# Altium schematic sheet Sheet1.SchDoc
size A1
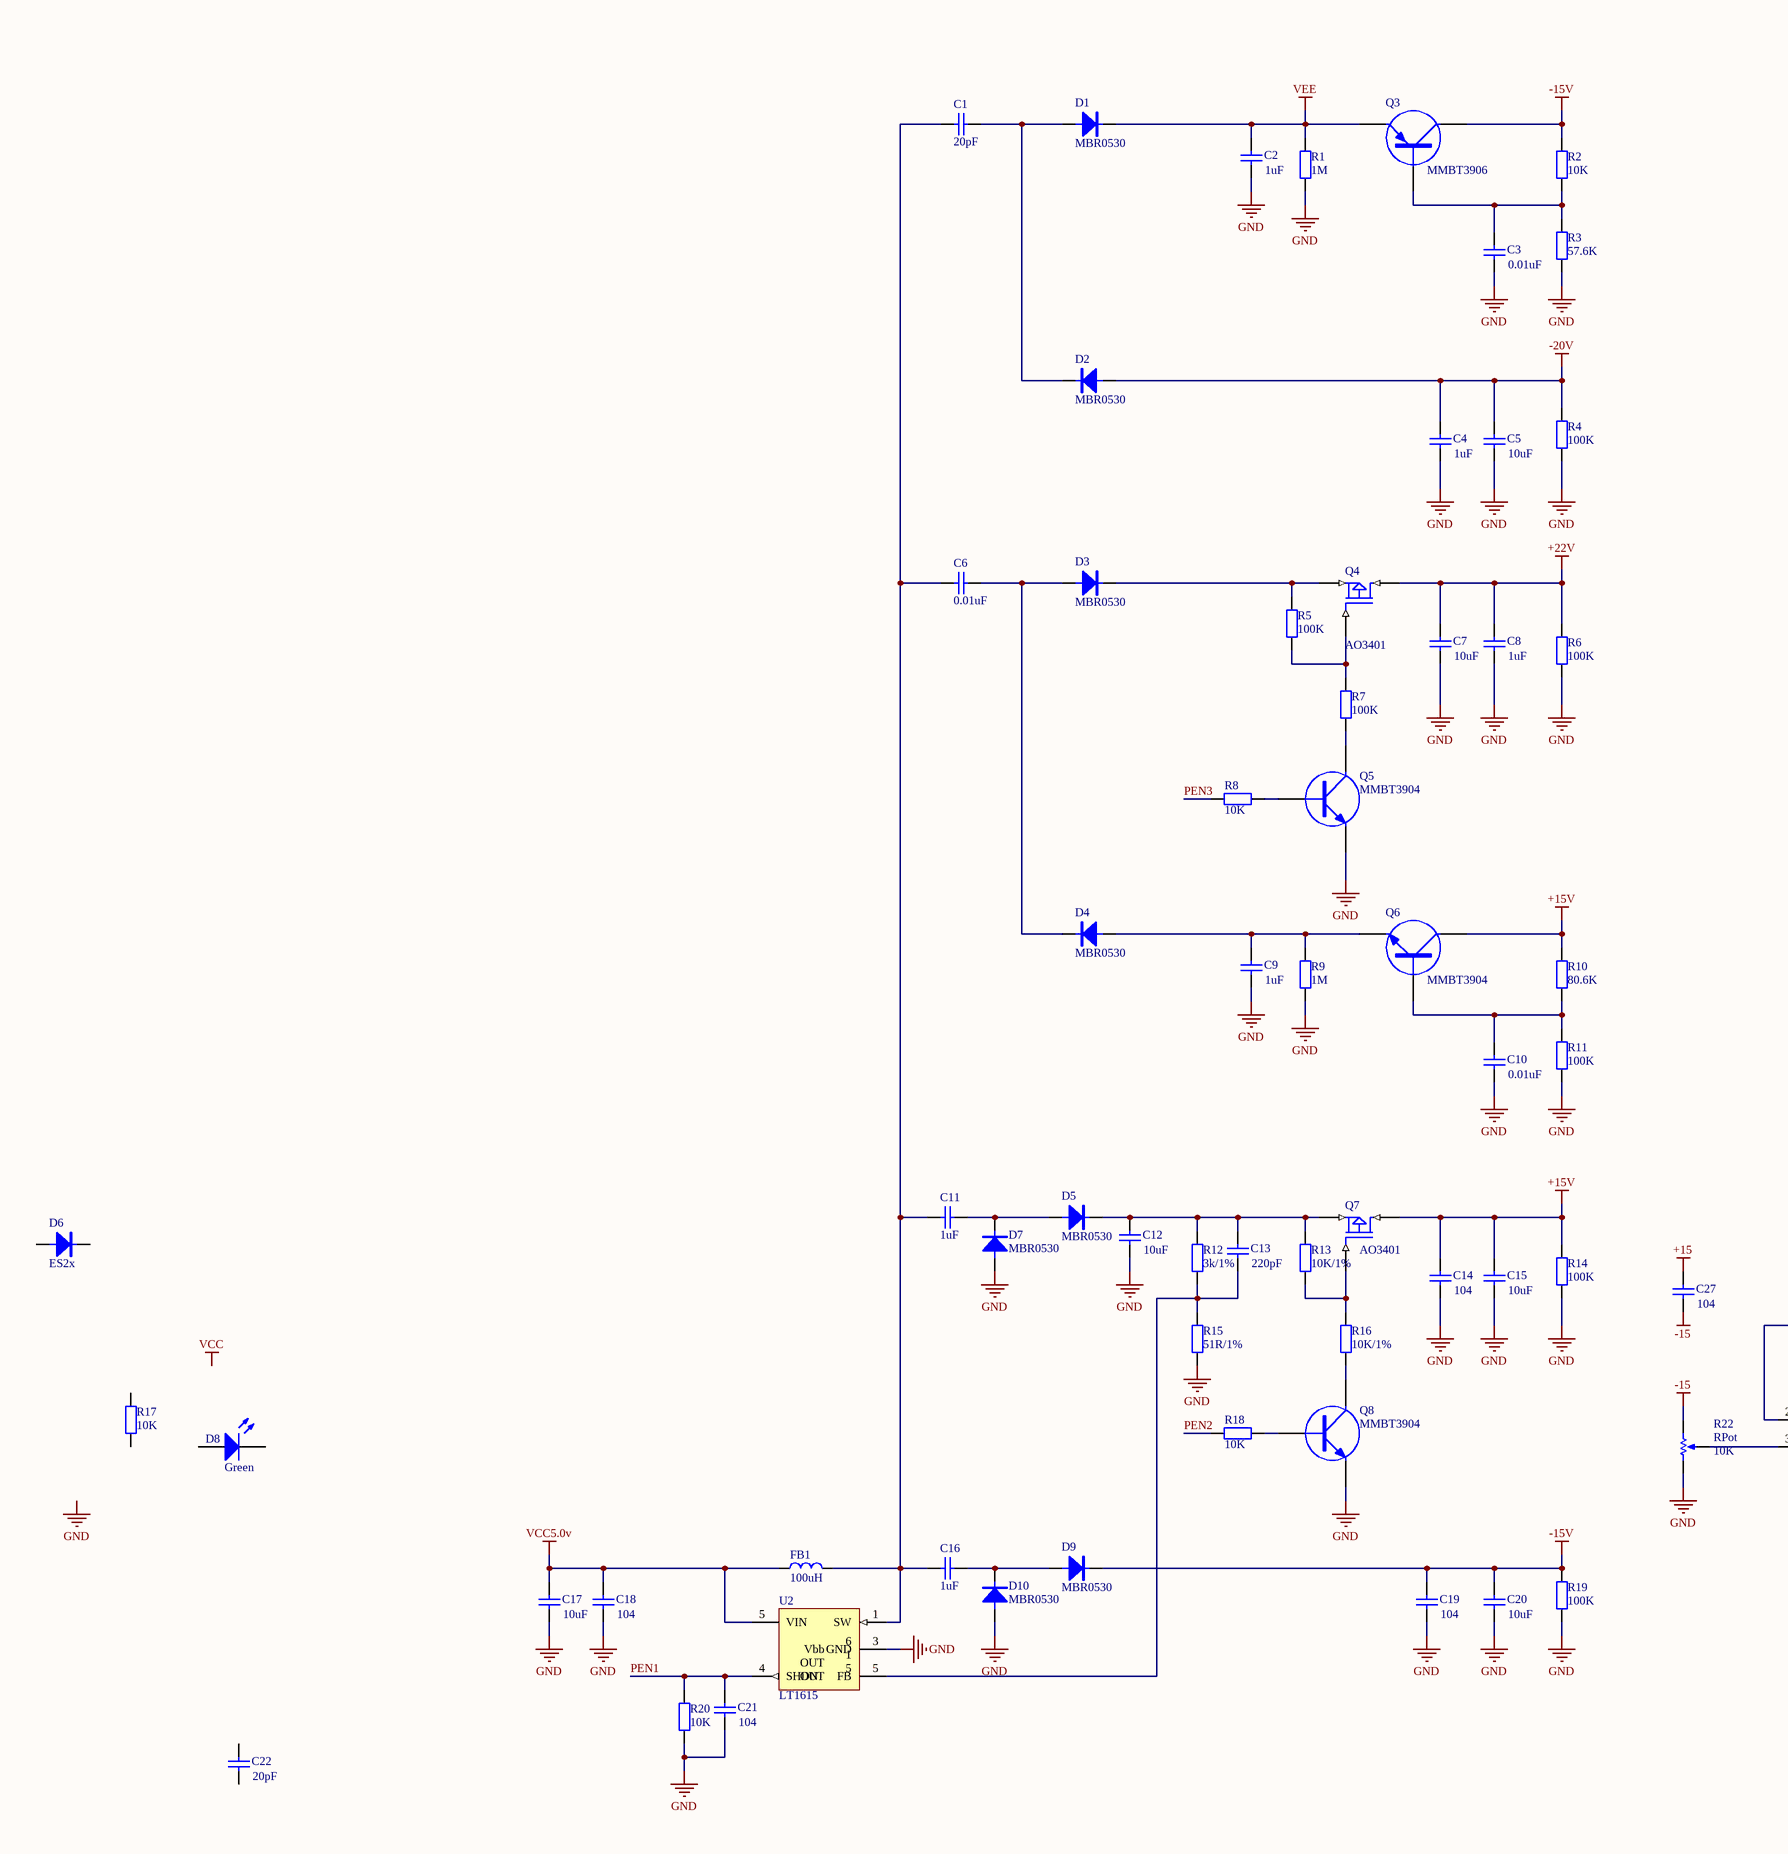
[diagram p0: Sheet1.SchDoc, left]
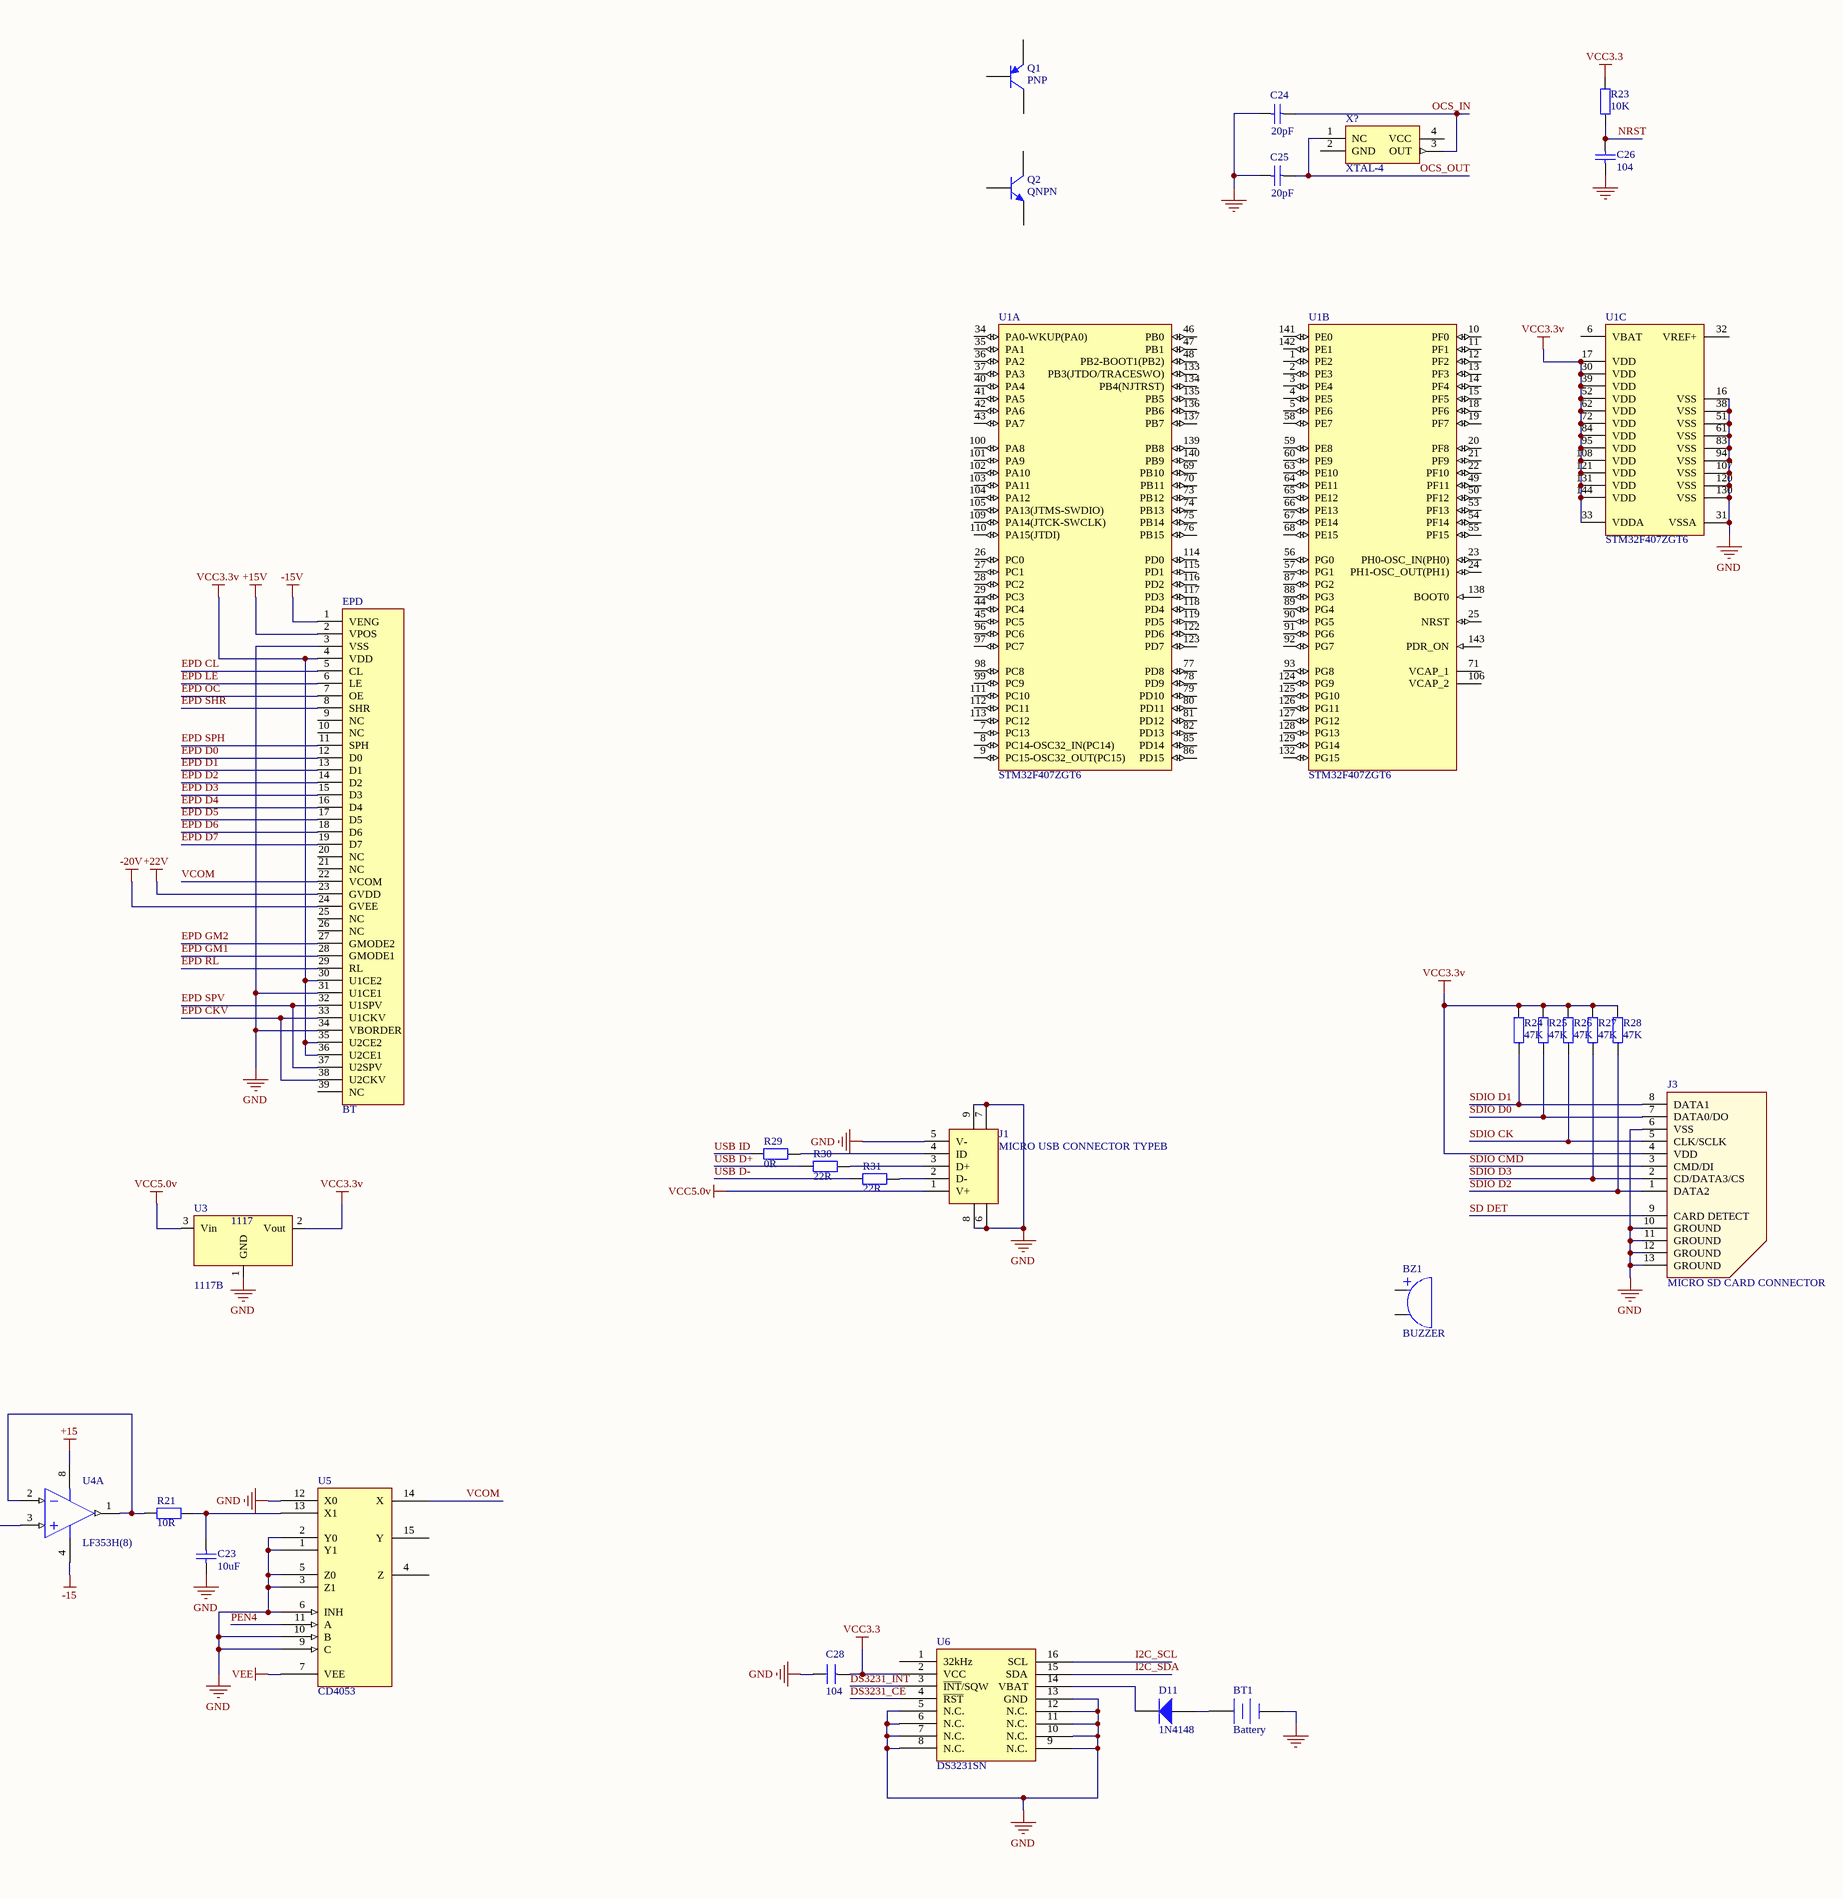
[diagram p1: Sheet1.SchDoc, right]

## Parts
BT1  Battery  [CR1220]
BZ1  BUZZER  [BUZZER-D12.0X8.5-6.5-0.8]
C1  20pF  [C0805]
C2  1uF  [C0805]
C3  0.01uF  [C0805]
C4  1uF  [C0805]
C5  10uF  [C0805]
C6  0.01uF  [C0805]
C7  10uF  [C0805]
C8  1uF  [C0805]
C9  1uF  [C0805]
C10  0.01uF  [C0805]
C11  1uF  [C0805]
C12  10uF  [C0805]
C13  220pF  [C0805]
C14  104  [C0805]
C15  10uF  [C0805]
C16  1uF  [C0805]
C17  10uF  [C0805]
C18  104  [C0805]
C19  104  [C0805]
C20  10uF  [C0805]
C21  104  [C0805]
C22  20pF  [C0805]
C23  10uF  [C0805]
C24  20pF  [C0805]
C25  20pF  [C0805]
C26  104  [C0805]
C27  104  [C0805]
C28  104  [C0805]
D1  MBR0530  [SMB]
D2  MBR0530  [SMB]
D3  MBR0530  [SMB]
D4  MBR0530  [SMB]
D5  MBR0530  [SMB]
D6  ES2x  [SMB]
D7  MBR0530  [SMB]
D8  Green  [C0805]
D9  MBR0530  [SMB]
D10  MBR0530  [SMB]
D11  1N4148  [425]
EPD  BT  [39FXL - duplicate]
FB1  100uH  [0805]
J1  MICRO USB CONNECTOR TYPEB  [MICRO USB CONNECTOR TYPEB-ST-MC-5F-01]
J3  MICRO SD CARD CONNECTOR  [MICRO SD CARD CONNECTOR]
Q1  PNP  [SOT-23B_N]
Q2  QNPN  [SOT-23B_N]
Q3  MMBT3906
Q4  AO3401
Q5  MMBT3904  [TO-92B]
Q6  MMBT3904  [TO-92B]
Q7  AO3401
Q8  MMBT3904  [TO-92B]
R1  1M  [C0805]
R2  10K  [C0805]
R3  57.6K  [C0805]
R4  100K  [C0805]
R5  100K  [C0805]
R6  100K  [C0805]
R7  100K  [C0805]
R8  10K  [C0805]
R9  1M  [C0805]
R10  80.6K  [C0805]
R11  100K  [C0805]
R12  3k/1%  [C0805]
R13  10K/1%  [C0805]
R14  100K  [C0805]
R15  51R/1%  [C0805]
R16  10K/1%  [C0805]
R17  10K  [C0805]
R18  10K  [C0805]
R19  100K  [C0805]
R20  10K  [C0805]
R21  10R  [C0805]
R22  RPot  value 10K  [VR5]
R23  10K  [C0805]
R24  47K  [C0805]
R25  47K  [C0805]
R26  47K  [C0805]
R27  47K  [C0805]
R28  47K  [C0805]
R29  0R  [C0805]
R30  22R  [C0805]
R31  22R  [C0805]
U1  STM32F407ZGT6  [STM-LQFP144_N]  (parts A,B,C of 3)
U2  LT1615
U3  1117B  [SOT-223]
U4  LF353H(8)  [SO-8]  (part A of 2)
U5  CD4053  [SO-16]
U6  DS3231SN  [DS3231]
X?  XTAL-4  [XTAL-5.0X3.2]

## Nets
+15: C27.1 U4.8(V+)
+15V: C14.1 C15.1 EPD.2(VPOS) Q6.3(C) Q7.2(D) R10.1 R14.1
+22V: C7.1 C8.1 EPD.23(GVDD) Q4.2(D) R6.1
-15: C27.2 R22.2(BOT) U4.4(V-)
-15V: C19.1 C20.1 D9.2(C) EPD.1(VENG) Q3.3(C) R2.1 R19.2
-20V: C4.1 C5.1 D2.1(A) EPD.24(GVEE) R4.1
GND: BT1.2(-) C2.2 C3.2 C4.2 C5.2 C7.2 C8.2 C9.2 C10.2 C12.1 C14.2 C15.2 C17.2 C18.2 C19.2 C20.2 C21.2 C23.2 C24.2 C25.2 C26.1 C28.2 D7.1(A) D10.1(A) EPD.3(VSS) EPD.31(U1CE1) EPD.34(VBORDER) J1.5(V-) J1.6 J1.7 J1.8 J1.9 J3.6(VSS) J3.10(GROUND) J3.11(GROUND) J3.12(GROUND) J3.13(GROUND) Q5.2(E) Q8.2(E) R1.2 R3.2 R4.2 R6.2 R9.2 R11.2 R14.2 R15.2 R19.1 R20.2 R22.1(TOP) U1.16(VSS) U1.31(VSSA) U1.38(VSS) U1.51(VSS) U1.61(VSS) U1.83(VSS) U1.94(VSS) U1.107(VSS) U1.120(VSS) U1.130(VSS) U2.3(GND) U3.1(GND) U5.1(Y1) U5.2(Y0) U5.3(Z1) U5.5(Z0) U5.6(INH) U5.8(GND) U5.9(C) U5.10(B) U5.12(X0) U6.5(N.C.) U6.6(N.C.) U6.7(N.C.) U6.8(N.C.) U6.9(N.C.) U6.10(N.C.) U6.11(N.C.) U6.12(N.C.) U6.13(GND)
VCC: U5.16(VCC)
VCC3.3: C28.1 R23.2 U6.2(VCC)
VCC3.3v: EPD.4(VDD) EPD.30(U1CE2) EPD.35(U2CE2) EPD.36(U2CE1) J3.4(VDD) R24.2 R25.2 R26.2 R27.2 R28.2 U1.17(VDD) U1.30(VDD) U1.33(VDDA) U1.39(VDD) U1.52(VDD) U1.62(VDD) U1.72(VDD) U1.84(VDD) U1.95(VDD) U1.108(VDD) U1.121(VDD) U1.131(VDD) U1.144(VDD) U3.2(Vout)
VCC5.0v: C17.1 C18.1 FB1.1 J1.1(V+) U2.5(VIN) U3.3(Vin)
VEE: C2.1 D1.2(C) Q3.2(E) R1.1 U5.7(VEE)
DS3231_CE: U6.4(~{RST})
DS3231_INT: U6.3(~{INT}/SQW)
EPD CKV: EPD.33(U1CKV) EPD.38(U2CKV)
EPD CL: EPD.5(CL)
EPD D0: EPD.12(D0)
EPD D1: EPD.13(D1)
EPD D2: EPD.14(D2)
EPD D3: EPD.15(D3)
EPD D4: EPD.16(D4)
EPD D5: EPD.17(D5)
EPD D6: EPD.18(D6)
EPD D7: EPD.19(D7)
EPD GM1: EPD.28(GMODE1)
EPD GM2: EPD.27(GMODE2)
EPD LE: EPD.6(LE)
EPD OC: EPD.7(OE)
EPD RL: EPD.29(RL)
EPD SHR: EPD.8(SHR)
EPD SPH: EPD.11(SPH)
EPD SPV: EPD.32(U1SPV) EPD.37(U2SPV)
I2C_SCL: U6.16(SCL)
I2C_SDA: U6.15(SDA)
NRST: C26.2 R23.1
OCS_IN: C24.1 X?.3(OUT)
OCS_OUT: C25.1 X?.1(NC)
PEN1: C21.1 R20.1 U2.4(SHDN)
PEN2: R18.1
PEN3: R8.1
PEN4: U5.11(A)
SD DET: J3.9(CARD_DETECT)
SDIO CK: J3.5(CLK/SCLK) R26.1
SDIO CMD: J3.3(CMD/DI)
SDIO D0: J3.7(DATA0/DO) R25.1
SDIO D1: J3.8(DATA1) R24.1
SDIO D2: J3.1(DATA2) R28.1
SDIO D3: J3.2(CD/DATA3/CS) R27.1
USB D+: R30.1
USB D-: R31.1
USB ID: R29.1
VCOM: EPD.22(VCOM) U5.14(X)
NetBT1_1: BT1.1(+) D11.1(A)
NetC1_1: C1.1 C6.1 C11.1 C16.1 FB1.2 U2.1(OUT)
NetC1_2: C1.2 D1.1(A) D2.2(C)
NetC3_1: C3.1 Q3.1(B) R2.2 R3.1
NetC6_2: C6.2 D3.1(A) D4.2(C)
NetC9_1: C9.1 D4.1(A) Q6.2(E) R9.1
NetC10_1: C10.1 Q6.1(B) R10.2 R11.1
NetC11_2: C11.2 D5.1(A) D7.2(C)
NetC12_2: C12.2 C13.1 D5.2(C) Q7.3(S) R12.1 R13.1
NetC13_2: C13.2 R12.2 R15.1 U2.5(OUT)
NetC16_2: C16.2 D9.1(A) D10.2(C)
NetC23_1: C23.1 R21.2 U5.13(X1)
NetD3_2: D3.2(C) Q4.3(S) R5.1
NetD11_2: D11.2(K) U6.14(VBAT)
NetJ1_2: J1.2(D-) R31.2
NetJ1_3: J1.3(D+) R30.2
NetJ1_4: J1.4(ID) R29.2
NetQ4_1: Q4.1(G) R5.2 R7.2
NetQ5_1: Q5.1(B) R8.2
NetQ5_3: Q5.3(C) R7.1
NetQ7_1: Q7.1(G) R13.2 R16.2
NetQ8_1: Q8.1(B) R18.2
NetQ8_3: Q8.3(C) R16.1
NetR21_1: R21.1 U4.1(OUT1) U4.2(IN1-)
NetR22_3: R22.3(TAP) U4.3(IN1+)

Not connected (* = marked no-connect by the designer): BZ1 1 2; C22 1 2; D6 1(A) 2(C); D8 1(A) 2(K); EPD 9(NC) 10(NC) 20(NC) 21(NC) 25(NC) 26(NC) 39(NC); Q1 1(C) 2(B) 3(E); Q2 1(C) 2(B) 3(E); R17 1 2; U1 1(PE2) 2(PE3) 3(PE4) 4(PE5) 5(PE6) 6(VBAT) 7(PC13) 8(PC14-OSC32_IN(PC14)) 9(PC15-OSC32_OUT(PC15)) 10(PF0) 11(PF1) 12(PF2) 13(PF3) 14(PF4) 15(PF5) 18(PF6) 19(PF7) 20(PF8) 21(PF9) 22(PF10) 23(PH0-OSC_IN(PH0)) 24(PH1-OSC_OUT(PH1)) 25(NRST) 26(PC0) 27(PC1) 28(PC2) 29(PC3) 32(VREF+) 34(PA0-WKUP(PA0)) 35(PA1) 36(PA2) 37(PA3) 40(PA4) 41(PA5) 42(PA6) 43(PA7) 44(PC4) 45(PC5) 46(PB0) 47(PB1) 48(PB2-BOOT1(PB2)) 49(PF11) 50(PF12) 53(PF13) 54(PF14) 55(PF15) 56(PG0) 57(PG1) 58(PE7) 59(PE8) 60(PE9) 63(PE10) 64(PE11) 65(PE12) 66(PE13) 67(PE14) 68(PE15) 69(PB10) 70(PB11) 71(VCAP_1) 73(PB12) 74(PB13) 75(PB14) 76(PB15) 77(PD8) 78(PD9) 79(PD10) 80(PD11) 81(PD12) 82(PD13) 85(PD14) 86(PD15) 87(PG2) 88(PG3) 89(PG4) 90(PG5) 91(PG6) 92(PG7) 93(PG8) 96(PC6) 97(PC7) 98(PC8) 99(PC9) 100(PA8) 101(PA9) 102(PA10) 103(PA11) 104(PA12) 105(PA13(JTMS-SWDIO)) 106(VCAP_2) 109(PA14(JTCK-SWCLK)) 110(PA15(JTDI)) 111(PC10) 112(PC11) 113(PC12) 114(PD0) 115(PD1) 116(PD2) 117(PD3) 118(PD4) 119(PD5) 122(PD6) 123(PD7) 124(PG9) 125(PG10) 126(PG11) 127(PG12) 128(PG13) 129(PG14) 132(PG15) 133(PB3(JTDO/TRACESWO)) 134(PB4(NJTRST)) 135(PB5) 136(PB6) 137(PB7) 138(BOOT0) 139(PB8) 140(PB9) 141(PE0) 142(PE1) 143(PDR_ON); U2 6(Vbb); U5 4(Z) 15(Y); U6 1(32kHz); X? 2(GND) 4(VCC)

## Notes on the sheet
- Labels drawn without touching a wire or pin: GND, VCC
- (in symbol 1117B) 1117

## Library data of the parts
BT1 = Battery: Multicell Battery; Published: 24-Mar-1999; LatestRevisionDate: 17-Jul-2002; LatestRevisionNote: Re-released for DXP Platform.; Publisher: Altium Limited
C1-C11 C14-C23 C27 = CAP: Capacitor; Value: 220pF; Published: 8-Jun-2000; LatestRevisionDate: 17-Jul-2002; LatestRevisionNote: Re-released for DXP Platform.; PackageReference: RAD-0.3; Publisher: Altium Limited
C12 C13 C28 = CAP: Capacitor
  C12: Published: 8-Jun-2000; LatestRevisionDate: 17-Jul-2002; LatestRevisionNote: Re-released for DXP Platform.; PackageReference: RAD-0.3; Publisher: Altium Limited; Value: 10uF
  C13: Published: 8-Jun-2000; LatestRevisionDate: 17-Jul-2002; LatestRevisionNote: Re-released for DXP Platform.; PackageReference: RAD-0.3; Publisher: Altium Limited; Value: 220pF
C24-C26 = Cap: Capacitor; Published: 8-Jun-2000; LatestRevisionDate: 17-Jul-2002; LatestRevisionNote: Re-released for DXP Platform.; PackageReference: RAD-0.3; Publisher: Altium Limited
  C24: Value: 20pF
D1-D7 D9 D10 = ES2x: Diode
D8 = LED2: Typical RED, GREEN, YELLOW, AMBER GaAs LED; Published: 8-Jun-2000; LatestRevisionDate: 17-Jul-2002; LatestRevisionNote: Re-released for DXP Platform.; PackageDocument: Feb-2002; PackageReference: 3.2X1.6X1.1; Publisher: Altium Limited
D11 = Diode: Default Diode; Published: 8-Jun-2000; LatestRevisionDate: 17-Jul-2002; LatestRevisionNote: Re-released for DXP Platform.; Publisher: Altium Limited; Code_JEDEC: DO-214-AB
EPD = ED060SC4(H2): Connector
FB1 = FB: Ferrite Bead
J1 = MICRO USB CONNECTOR TYPEB: USB Connector
Q1 = PNP: PNP Bipolar Transistor; Published: 8-Jun-2000; LatestRevisionDate: 29-May-2009; LatestRevisionNote: IPC-7351 Footprint Added.; PackageVersion: Aug-1999; PackageReference: SOT-23B; Publisher: Altium Limited; PackageDescription: 3-Pin SOT-23 Package 0.95 mm Pitch, 2.4 mm Lead Span
Q2 = QNPN: NPN Bipolar Transistor; Published: 8-Jun-2000; LatestRevisionDate: 29-May-2009; LatestRevisionNote: IPC-7351 Footprint Added.; PackageVersion: Aug-1999; PackageReference: SOT-23B; Publisher: Altium Limited; PackageDescription: 3-Pin SOT-23 Package 0.95 mm Pitch, 2.4 mm Lead Span
Q3 = PNP: PNP Transistor
Q4 Q7 = MOSFET P
Q5 Q6 Q8 = NPN: NPN Transistor
R1-R21 R23-R31 = Res2: Resistor; Published: 8-Jun-2000; LatestRevisionDate: 17-Jul-2002; LatestRevisionNote: Re-released for DXP Platform.; PackageReference: AXIAL-0.4; Publisher: Altium Limited
  R24-R28: PackageDescription: Axial Device, Thru-Hole; 2 Leads; 0.4 in Pin Spacing
R22 = RPot: Potentiometer; Sim Note: Enter the Resistance value and the set point into parameter fields.; Set Position: 0.5; Published: 8-Jun-2000; LatestRevisionDate: 17-Jul-2002; LatestRevisionNote: Re-released for DXP Platform.; PackageReference: VR5; Publisher: Altium Limited; PackageDescription: Variable Resistor, Thru-Hole; 3 Leads
U1 = STM32F407ZGT6: ARM Cortex-M4 32-bit MCU+FPU, 210 DMIPS, 1024 kB Flash, 192 kB Internal RAM, 114 I/Os, 144-pin LQFP, -40 to 85 degC, Tray; Manufacturer: STMicroelectronics; D/A Converter: 2x12-bit; FLASH Size (Prog) (kB): 1024; I/Os (High Current): 114; Internal RAM Size (kB): 192; Operating Frequency(F) (Processor speed) (MHz): 168; Supply Voltage(Vcc) max (V): 3.6; Supply Voltage(Vcc) min (V): 1.8; DatasheetVersion: Rev. 4; PackageVersion: Rev. 4, 06/2013; PackageReference: LQFP144; PackageDescription: 144-Pin Low Profile Quad Flat Package, 20 x 20 mm Body, 0.5 mm Pitch; Supplier 1: Digi-Key; Supplier Part Number 1: 497-11766-ND; Supplier 2: Newark; Supplier Part Number 2: 73T2334; Supplier 3: Mouser; Supplier Part Number 3: 511-STM32F407ZGT6; Core: ARM Cortex-M4; Packing: Tray; Mounting Technology: Surface Mount; PartNumber: STM32F407ZGT6; ComponentLink1Description: Manufacturer URL; ComponentLink1URL: http://www.st.com/web/en/home.html; ComponentLink2Description: Datasheet; ComponentLink2URL: http://www.st.com/st-web-ui/static/active/en/resource/technical/document/datasheet/DM00037051.pdf; ComponentLink3Description: Package Specification; ComponentLink3URL: http://www.st.com/st-web-ui/static/active/en/resource/technical/document/datasheet/DM00037051.pdf
U4 = LF353H(8): Fast Settling Dual Operational Amplifier; Text Field1: pristel=Nsc\nsanopea\<parttype>.ckt
U5 = 4053
X? = XTAL-4: Oscillator